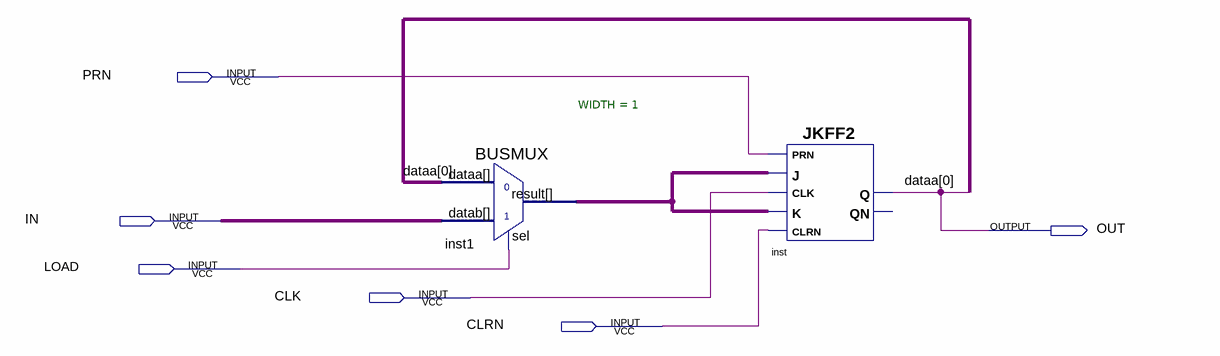
[diagram p0: schematic sheet]
// Quartus schematic registertff.bdf as structural Verilog: 2 symbols, 6 pins
module registertff (
  input  PRN,
  input  IN,
  input  LOAD,
  input  CLK,
  input  CLRN,
  output OUT
);

  wire inst1_result;

  BUSMUX #(.WIDTH(1)) inst1 (.datab(IN), .sel(LOAD), .dataa(OUT), .result(inst1_result));
  JKFF2 inst (.K(inst1_result), .CLRN(CLRN), .CLK(CLK), .PRN(PRN), .J(inst1_result), .Q(OUT));  // open: QN

  // Other names for the same wires on the sheet: dataa[0] = OUT
endmodule
